# EasyEDA Pro project ProProject_Access Control Core_2024-05-28.epro, schematic V2.0.1 Interface Schematic
Create Date: 2024-05-01; Page Name: P1; Project Name: Access Control V2; Schematic Name: V2.0.1 Interface Schematic; Update Date: 2024-05-07; Company: EasyEDA.com; Drawn: EasyEDA; Page Size: A4; Part Number: JLCPCB-002; Reviewed: EasyEDA; Version: V0.1
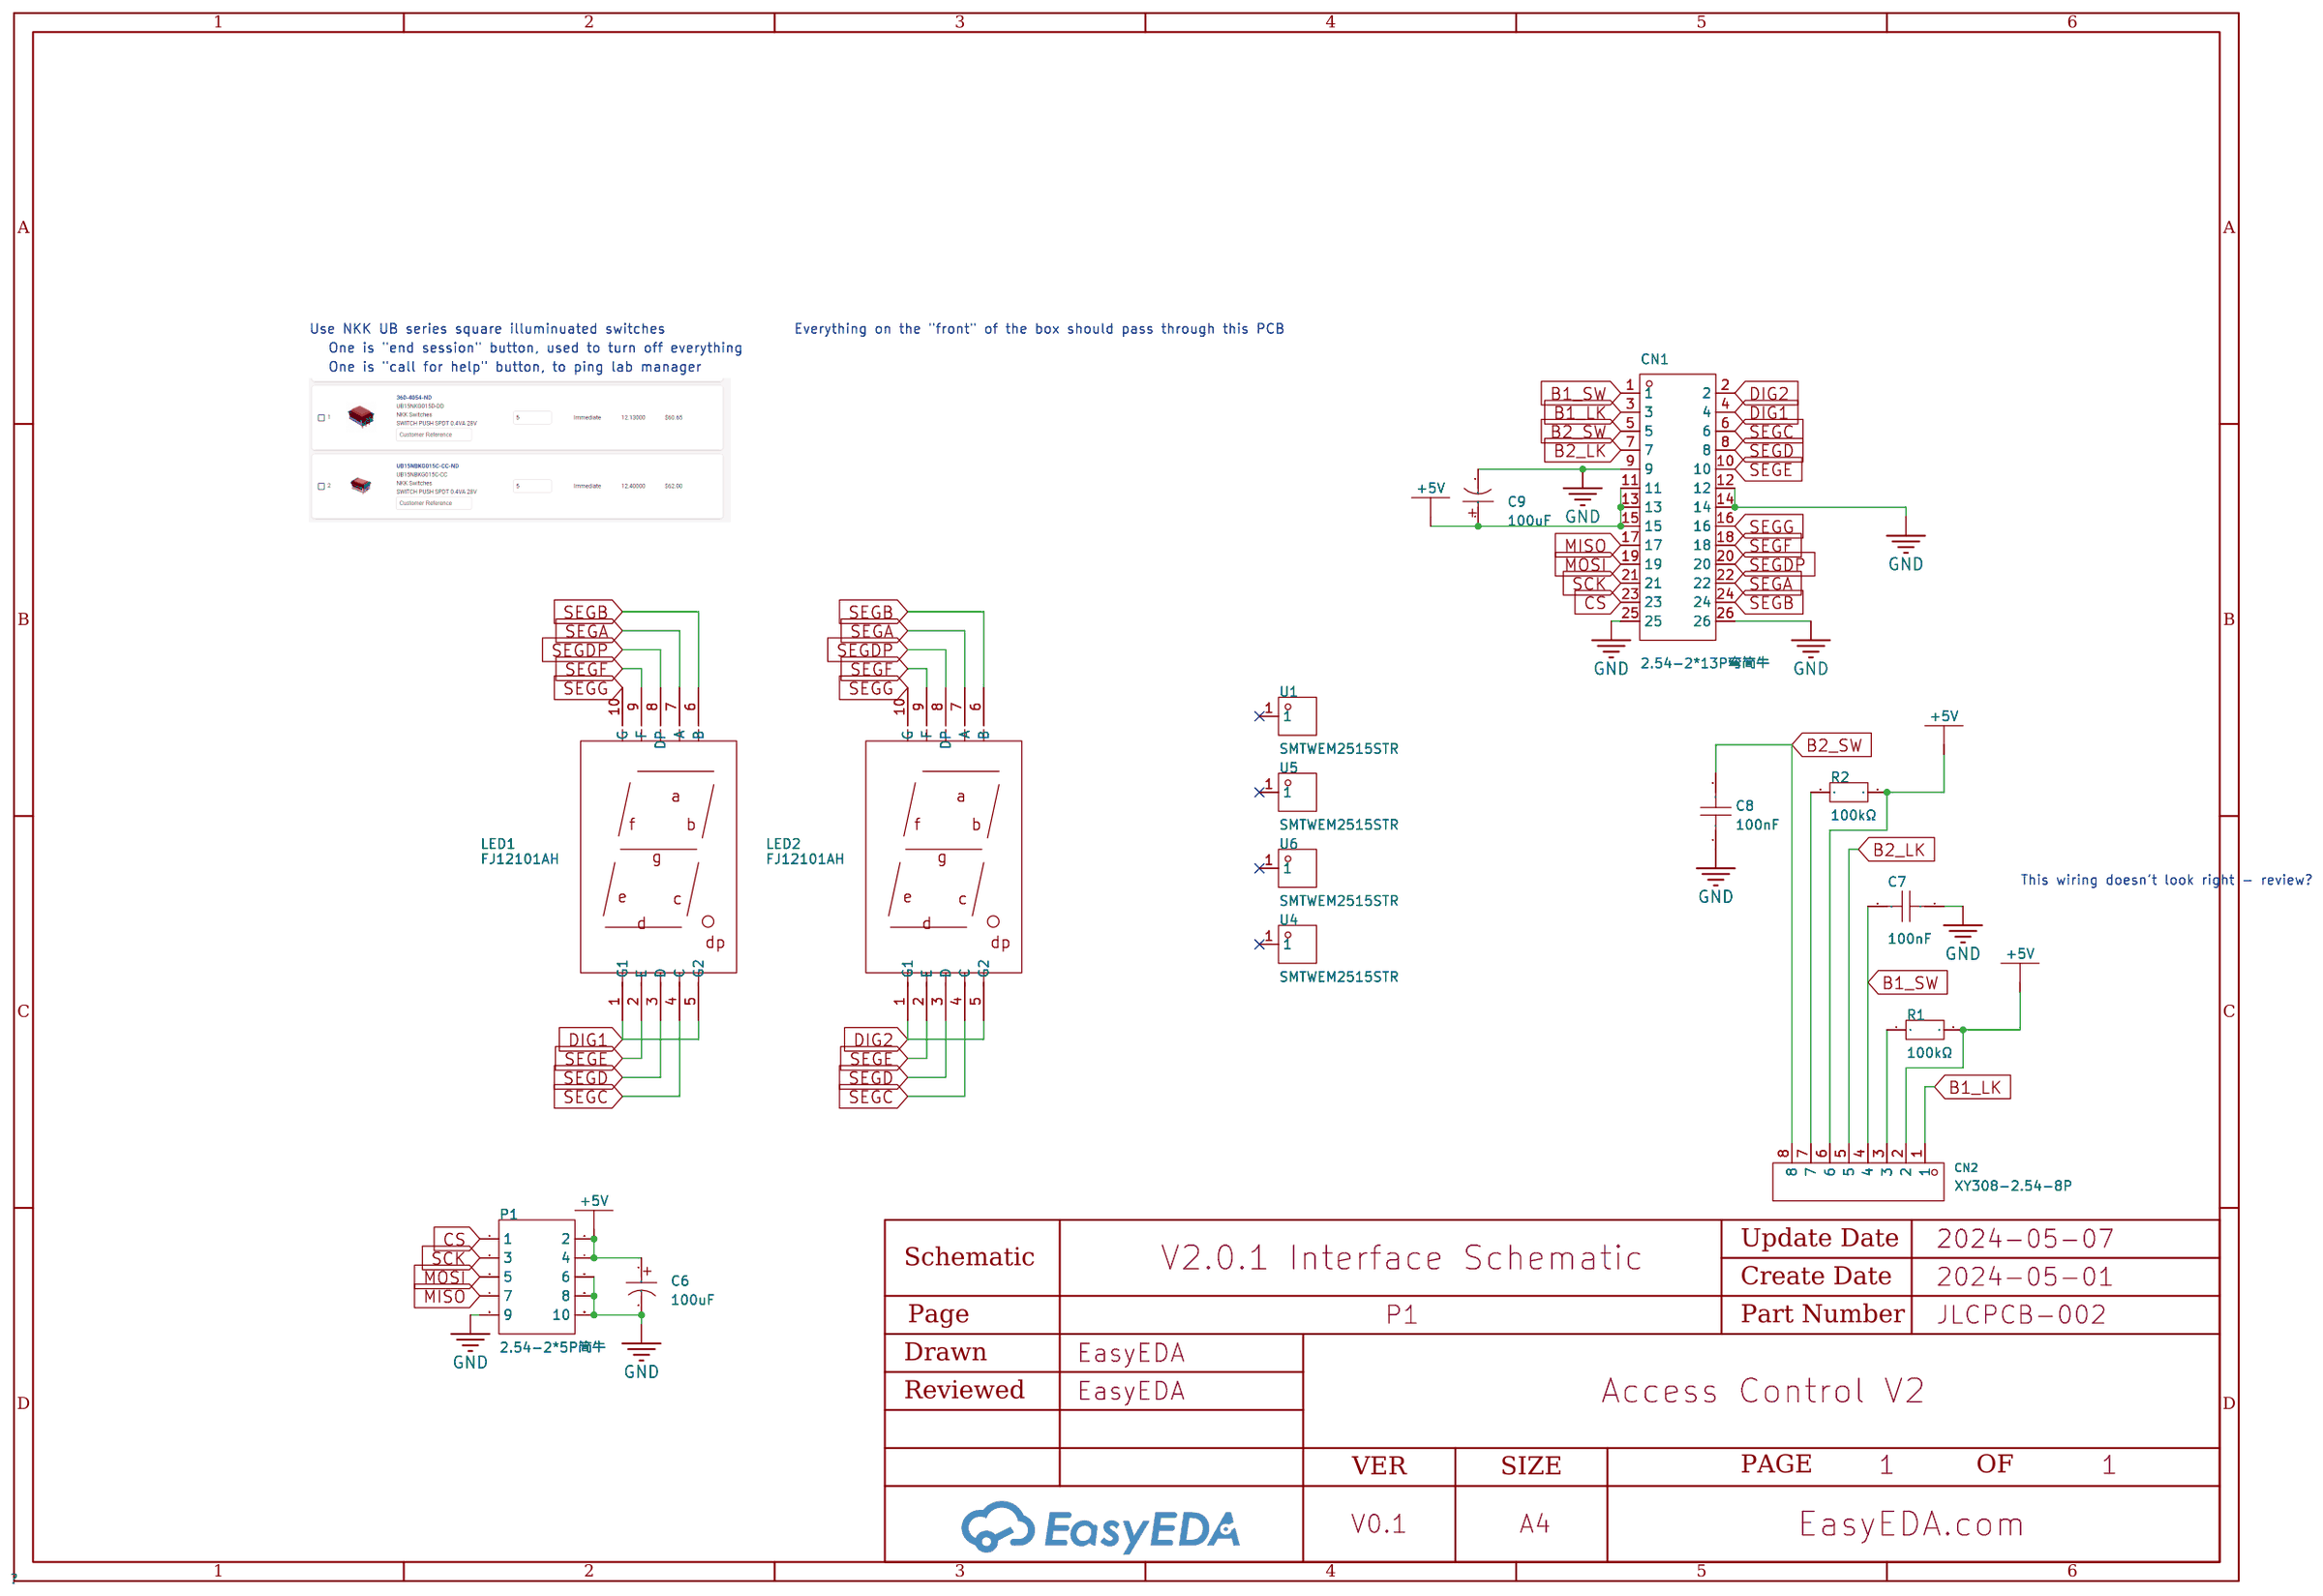
[diagram p2: schematic sheet]

## Parts
C6  100uF  [CAP-TH_BD5.0-P2.00-D0.8-FD]
C7  100nF  [CAP-TH_L4.2-W3.5-P2.54-D0.5]
C8  100nF  [CAP-TH_L4.2-W3.5-P2.54-D0.5]
C9  100uF  [CAP-TH_BD5.0-P2.00-D0.8-FD]
CN1  2.54-2*13P弯简牛  [IDC-TH_26P-P2.54_BOOMELE-2X13P-2.54MM-H]
CN2  XY308-2.54-8P  [CONN-TH_XY308-2.54-8P]
LED1  FJ12101AH  [LED-SEG-TH_10P-L28.8-W40.8-P2.54-S35.56-BL]
LED2  FJ12101AH  [LED-SEG-TH_10P-L28.8-W40.8-P2.54-S35.56-BL]
P1  2.54-2*5P简牛  [IDC-TH_10P-P2.54_C5665]
R1  100kΩ  [RES-TH_BD2.7-L6.2-P10.20-D0.4]
R2  100kΩ  [RES-TH_BD2.7-L6.2-P10.20-D0.4]
U1  SMTWEM2515STR  [SMD_BD5.0-D3.5]
U4  SMTWEM2515STR  [SMD_BD5.0-D3.5]
U5  SMTWEM2515STR  [SMD_BD5.0-D3.5]
U6  SMTWEM2515STR  [SMD_BD5.0-D3.5]

## Library data of the parts
C6 C9 = KS107M016D07RR0VH2FP0: Capacitance:100uF Tolerance:±20% Tolerance:±20% Rated Voltage: Ripple Current:- Equivalent Series Resistance(ESR):- Lead Spacing: φD: L: Lifetime @ Temp:1000hrs@105℃ Operating Temperature:-40℃~+105℃ Operating Temperature:-40℃~+105℃; LCSC Part Name: 100uF ±20% 16V; Supplier Part: C43803; Manufacturer: CX(承兴); Supplier Footprint: 插件,D5xL7mm; JLCPCB Part Class: Extended Part; Datasheet: https://atta.szlcsc.com/upload/public/pdf/source/20230817/0DB19D47181DB7F2222DAA6444591EF5.pdf; Supplier: LCSC; Tolerance: ±20%; Lifetime @ Temp: 1000hrs@105℃; Operating Temperature: -40℃~+105℃
C7 C8 = 178MU0006: Capacitance: Tolerance:±10% Tolerance:±10% Voltage Rated: Temperature Coefficient:; LCSC Part Name: 100nF ±10% 50V; Supplier Part: C5632430; Manufacturer: KNSCHA(科尼盛); Supplier Footprint: 插件,P=2.54mm; JLCPCB Part Class: Extended Part; Datasheet: https://atta.szlcsc.com/upload/public/pdf/source/20230506/6B3136079A6D587E863927628E877AC6.pdf; Supplier: LCSC; Tolerance: ±10%
CN1 = 2.54-2*13P弯简牛: Connector Type:简牛座 Pitch:2.54mm Structure:2x13P Holder Type:Right-Angle Row Spacing:2.54mm Number of Rows:2 Pin Number in each Row:13 Contact Material:- Contact Plating:-; LCSC Part Name: 2.54mm 2x13P 排数:2 每排P数:13; Supplier Part: C21167; Manufacturer: BOOMELE(博穆精密); Supplier Footprint: 弯插,P=2.54mm; JLCPCB Part Class: Extended Part; Datasheet: https://atta.szlcsc.com/upload/public/pdf/source/20190318/C79866_F562B2ABC13A71FF1CBDB4755391DD5E.pdf; Supplier: LCSC; Connector Type: 简牛座; Pitch: 2.54mm; Structure: 2x13P; Holder Type: Right-Angle; Row Spacing: 2.54mm; Number of Rows: 2; Pin Number in each Row: 13
CN2 = XY308-2.54-8P: Structure:1x8P Pitch:2.54mm Color:Green Mounting Style:Straight Current Rating (Max):6A Voltage Rating (Max):150V Number of Pins:8P Number of Rows:1 Wire Gauge - AWG:18~26 Wire Gauge - AWG:18~26 Wire Gauge - mm2:1 Wire Gauge - mm2:1 Number of PINs Per Row; LCSC Part Name: 2.54mm 1x8P 排数:1 每排P数:8 直插; Supplier Part: C915917; Manufacturer: XINLAIYA(新莱亚); Supplier Footprint: 插件,P=2.54mm; JLCPCB Part Class: Extended Part; Datasheet: https://atta.szlcsc.com/upload/public/pdf/source/20201124/C915917_D8631AC48954148149438E3FF38E8451.pdf; Supplier: LCSC; Structure: 1x8P; Pitch: 2.54mm; Color: Green; Mounting Style: Straight; Current Rating (Max): 6A; Voltage Rating (Max): 150V; Number of Pins: 8P; Number of Rows: 1; Wire Gauge - AWG: 18~26; Wire Gauge - mm2: 1; Number of PINs Per Row: 8
LED1 LED2 = FJ12101AH: Number of Characters:1Bit Luminous Color:Red LED Polarity:共阴极 Digit/Alpha Size(inch):1.2; LCSC Part Name: 1位1.2英寸红色数码管 共阴极; Supplier Part: C53679; Manufacturer: 志浩; Supplier Footprint: 插件; JLCPCB Part Class: Extended Part; Datasheet: https://atta.szlcsc.com/upload/public/pdf/source/20151111/1457707576612.pdf; Supplier: LCSC; Number of Characters: 1Bit; Luminous Color: Red; LED Polarity: 共阴极; Digit/Alpha Size(inch): 1.2
P1 = 2.54-2*5P简牛: Connector Type:简牛座 Pitch:2.54mm Structure:2x5P Holder Type:Straight Row Spacing:2.54mm Number of Rows:2 Pin Number in each Row:5 Contact Material:- Contact Plating:-; LCSC Part Name: 2.54mm 2x5P 排数:2 每排P数:5; Supplier Part: C5665; Manufacturer: BOOMELE(博穆精密); Supplier Footprint: 插件,P=2.54mm; JLCPCB Part Class: Extended Part; Datasheet: https://atta.szlcsc.com/upload/public/pdf/source/20140331/1457707037896.pdf; Supplier: LCSC; Connector Type: 简牛座; Pitch: 2.54mm; Structure: 2x5P; Holder Type: Straight; Row Spacing: 2.54mm; Number of Rows: 2; Pin Number in each Row: 5
R1 R2 = MF1/4W-100K±1%-ST26: Type:Metal Film Resistors Resistance: Tolerance:±1% Tolerance:±1% Overload Voltage (Max):250V Power(Watts):250mW Temperature Coefficient:±100ppm/℃ Temperature Coefficient:±100ppm/℃ Operating Temperature Range:-55℃~+155℃ Operating Temperature Range:-55℃~+1; LCSC Part Name: 金属膜电阻 100kΩ ±1% 250mW; Supplier Part: C2903268; Manufacturer: VO(翔胜); Supplier Footprint: 插件,2.7x6.2mm; JLCPCB Part Class: Extended Part; Datasheet: https://atta.szlcsc.com/upload/public/pdf/source/20200609/C601728_5AA4C0C8E12E11069DA2C3356F29D1F2.pdf; Supplier: LCSC; Type: Metal Film Resistors; Tolerance: ±1%; Overload Voltage (Max): 250V; Power(Watts): 250mW; Temperature Coefficient: ±100ppm/℃; Operating Temperature Range: -55℃~+155℃
U1 U4-U6 = SMTWEM2515STR: LCSC Part Name: M2.5 贴片螺母 L=1.5mm; Supplier Part: C5301785; Manufacturer: YIYUAN(怡远); Supplier Footprint: M2.5; Datasheet: https://atta.szlcsc.com/upload/public/pdf/source/20221206/40612B47A9AD06C6C88211E02916916D.pdf; Supplier: LCSC

## Nets
+5V: C6.1 C9.1 CN1.11 CN1.13 CN1.15 CN2.2 CN2.6 P1.2 P1.4 R1.2 R2.2
GND: C6.2 C7.1 C8.1 C9.2 CN1.9 CN1.12 CN1.14 CN1.25 CN1.26 P1.6 P1.8 P1.9 P1.10
B1_LK: CN1.3 CN2.1
B1_SW: C7.2 CN1.1 CN2.4
B2_LK: CN1.7 CN2.5
B2_SW: C8.2 CN1.5 CN2.8
CS: CN1.23 P1.1
DIG1: CN1.4 LED1.1(G1) LED1.5(G2)
DIG2: CN1.2 LED2.1(G1) LED2.5(G2)
MISO: CN1.17 P1.7
MOSI: CN1.19 P1.5
SCK: CN1.21 P1.3
SEGA: CN1.22 LED1.7(A) LED2.7(A)
SEGB: CN1.24 LED1.6(B) LED2.6(B)
SEGC: CN1.6 LED1.4(C) LED2.4(C)
SEGD: CN1.8 LED1.3(D) LED2.3(D)
SEGDP: CN1.20 LED1.8(DP) LED2.8(DP)
SEGE: CN1.10 LED1.2(E) LED2.2(E)
SEGF: CN1.18 LED1.9(F) LED2.9(F)
SEGG: CN1.16 LED1.10(G) LED2.10(G)
$1N1480: CN2.3 R1.1
$1N2767: CN2.7 R2.1

Not connected (* = marked no-connect by the designer): U1 1*; U4 1*; U5 1*; U6 1*

## Notes on the sheet
- Use NKK UB series square illuminuated switches
- Everything on the "front" of the box should pass through this PCB
- One is "end session" button, used to turn off everything
- One is "call for help" button, to ping lab manager
- This wiring doesn't look right - review?
